# Altium schematic sheet LAN8742A.SchDoc
size A3; SheetNumber: 1; SheetTotal: 16
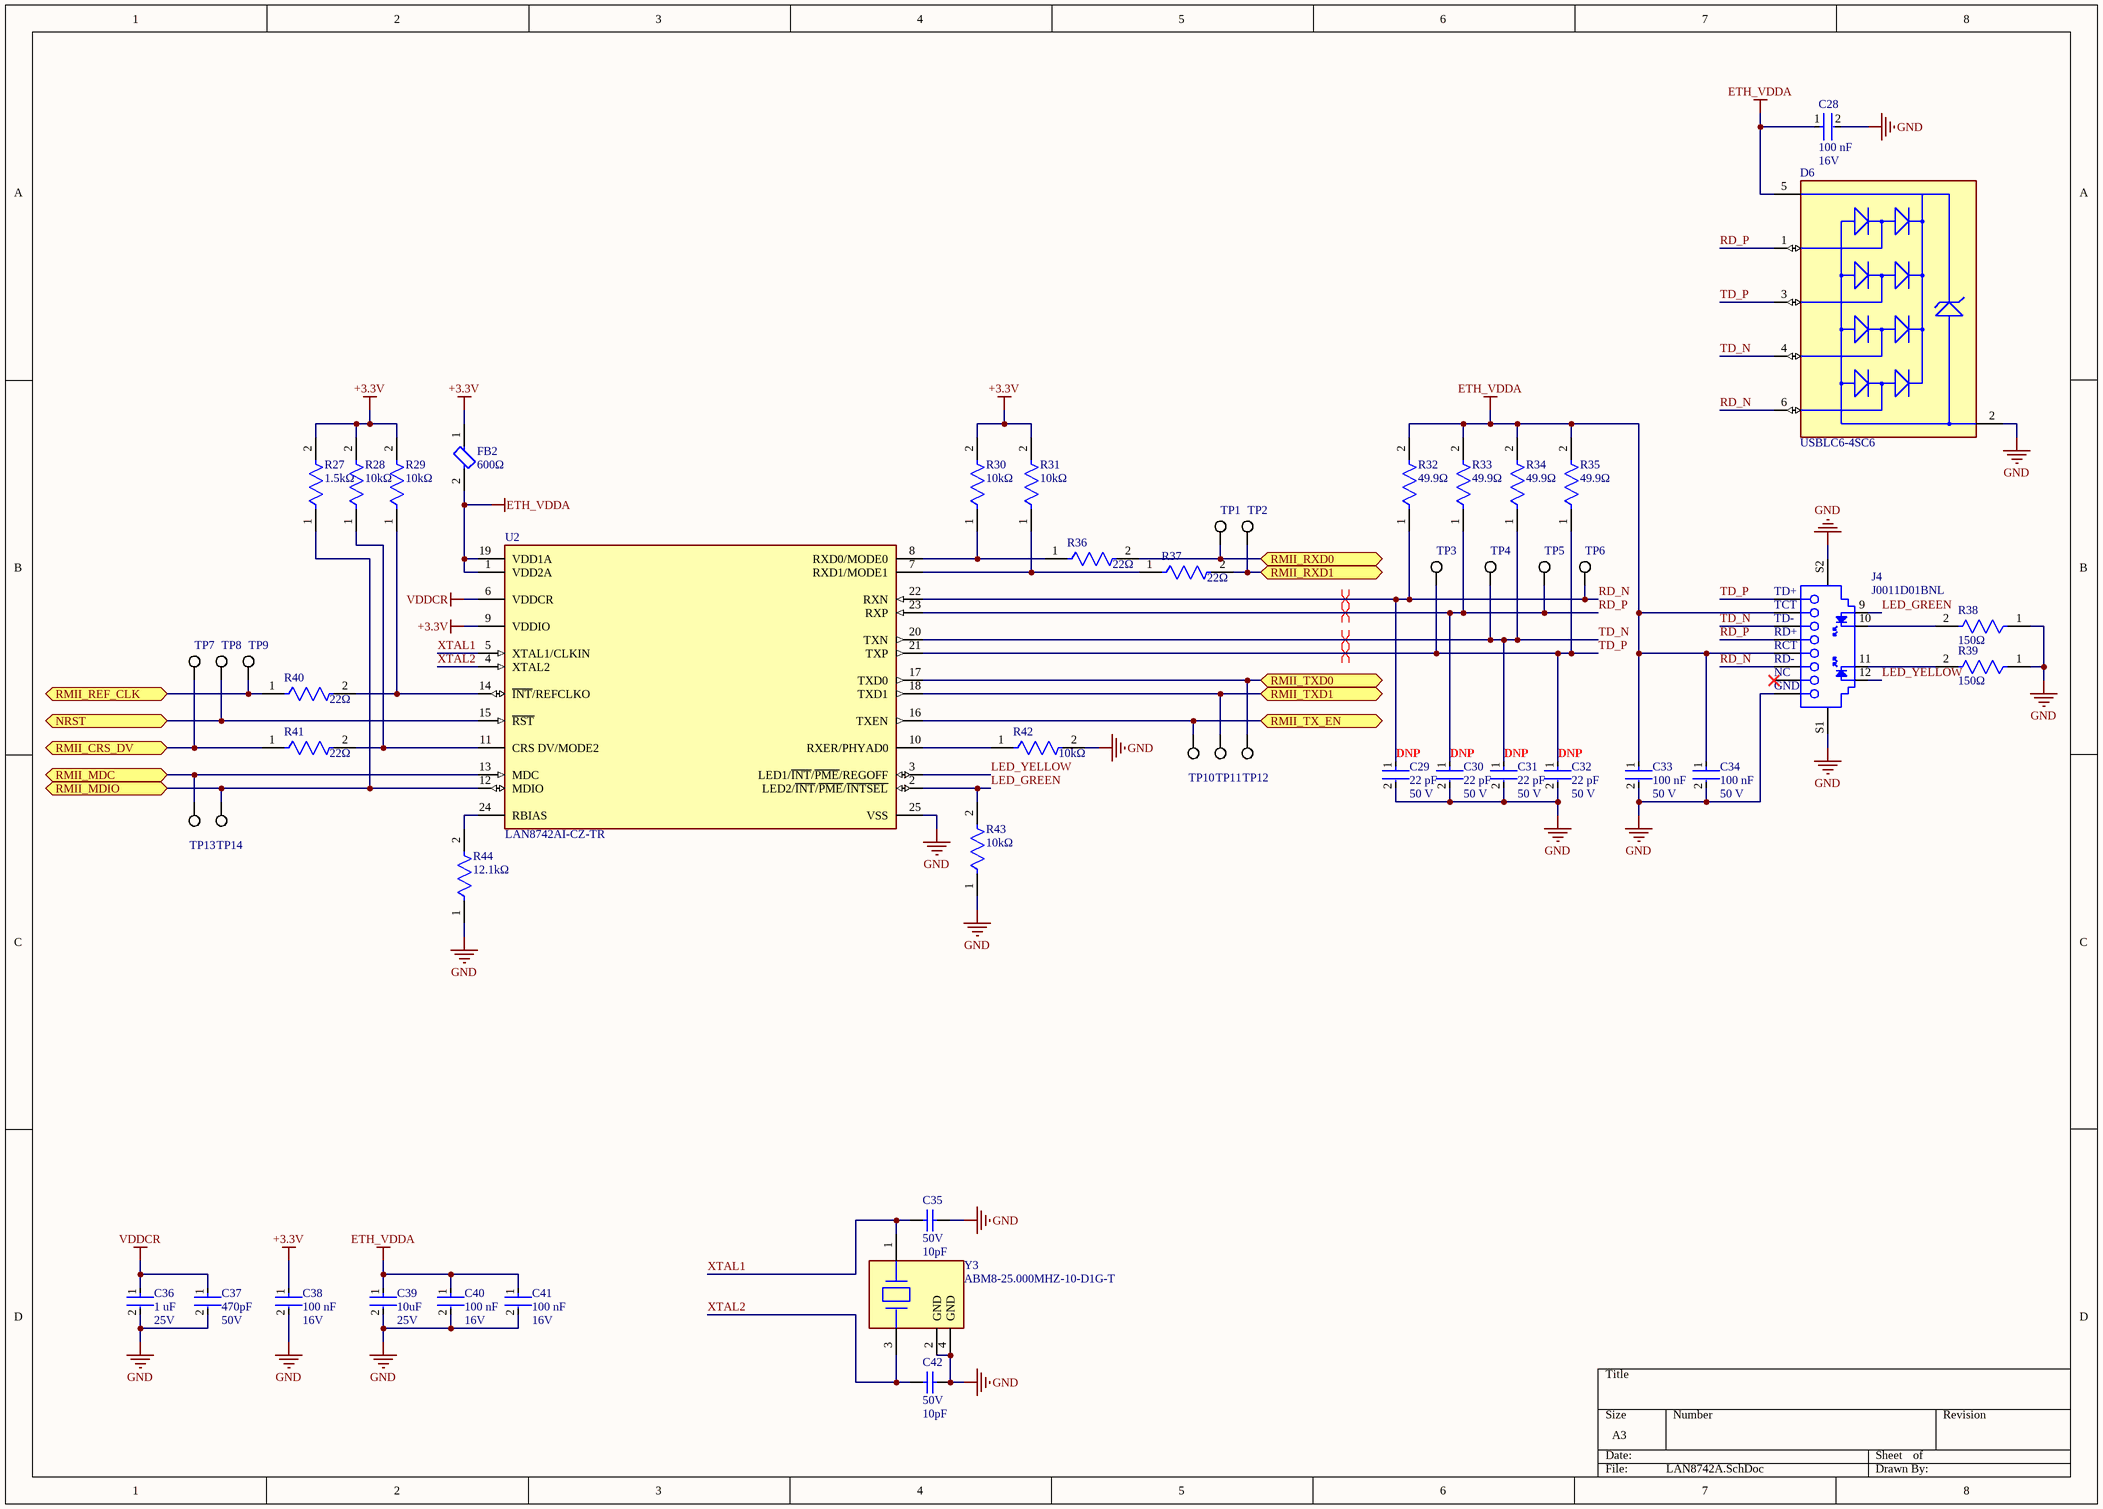
[diagram p0: LAN8742A.SchDoc]

## Parts
C28  Capacitance: 100 nF  Voltage Rating: 16V  [FP-CL752-IPC_B]  (hidden comment: CL05B104KO5VPNC)
C29  Capacitance: 22 pF  Voltage Rating: 50 V  [FP-C0402-BB-IPC_B]  (hidden comment: C0402C220K5GACTU)
C30  Capacitance: 22 pF  Voltage Rating: 50 V  [FP-C0402-BB-IPC_B]  (hidden comment: C0402C220K5GACTU)
C31  Capacitance: 22 pF  Voltage Rating: 50 V  [FP-C0402-BB-IPC_B]  (hidden comment: C0402C220K5GACTU)
C32  Capacitance: 22 pF  Voltage Rating: 50 V  [FP-C0402-BB-IPC_B]  (hidden comment: C0402C220K5GACTU)
C33  value 100 nF  Voltage Rating: 50 V  [FP-C0603C-CF-IPC_B]  (hidden comment: C0603C104M5RACTU)
C34  value 100 nF  Voltage Rating: 50 V  [FP-C0603C-CF-IPC_B]  (hidden comment: C0603C104M5RACTU)
C35  Voltage Rating: 50V  Capacitance: 10pF  [CAPC1005X55X25NL05T05]  (hidden comment: CC0402JRNPO9BN100)
C36  Capacitance: 1 uF  Voltage Rating: 25V  [FP-GCM188-0_1-IPC_B]  (hidden comment: GCM188R71E105KA64D)
C37  Voltage: 50V  Capacitance: 470pF  [FP-0402-L_1_0_1-W_0_5_0_1-MFG]  (hidden comment: 04025C471JAT2A)
C38  Capacitance: 100 nF  Voltage Rating: 16V  [FP-CL752-IPC_B]  (hidden comment: CL05B104KO5VPNC)
C39  Voltage Rating: 25V  Capacitance: 10uF  [FP-C1608-080-IPC_B]  (hidden comment: C1608X5R1E106M080AC)
C40  Capacitance: 100 nF  Voltage Rating: 16V  [FP-CL752-IPC_B]  (hidden comment: CL05B104KO5VPNC)
C41  Capacitance: 100 nF  Voltage Rating: 16V  [FP-CL752-IPC_B]  (hidden comment: CL05B104KO5VPNC)
C42  Voltage Rating: 50V  Capacitance: 10pF  [CAPC1005X55X25NL05T05]  (hidden comment: CC0402JRNPO9BN100)
D6  USBLC6-4SC6  [FP-SOT23-6L-MFG]
FB2  Impedance: 600Ω  [FP-BLM18-0_15-t0_8-IPC_B]  (hidden comment: BLM18AG601SN1D)
J4  J0011D01BNL  [PULS-J0-A_V]
R27  Resistance: 1.5kΩ  [FP-ERJ2RK-MFG]  (hidden comment: ERJ-2RKF1501X)
R28  Resistance: 10kΩ  [FP-AC0402-MFG]  (hidden comment: AC0402FR-0710KL)
R29  Resistance: 10kΩ  [FP-AC0402-MFG]  (hidden comment: AC0402FR-0710KL)
R30  Resistance: 10kΩ  [FP-AC0402-MFG]  (hidden comment: AC0402FR-0710KL)
R31  Resistance: 10kΩ  [FP-AC0402-MFG]  (hidden comment: AC0402FR-0710KL)
R32  Resistance: 49.9Ω  [FP-AC0402-MFG]  (hidden comment: AC0402FR-0749R9L)
R33  Resistance: 49.9Ω  [FP-AC0402-MFG]  (hidden comment: AC0402FR-0749R9L)
R34  Resistance: 49.9Ω  [FP-AC0402-MFG]  (hidden comment: AC0402FR-0749R9L)
R35  Resistance: 49.9Ω  [FP-AC0402-MFG]  (hidden comment: AC0402FR-0749R9L)
R36  Resistance: 22Ω  [FP-AC0402-MFG]  (hidden comment: AC0402FR-0722RL)
R37  Resistance: 22Ω  [FP-AC0402-MFG]  (hidden comment: AC0402FR-0722RL)
R38  Resistance: 150Ω  [FP-CRCW0603-e3-IPC_B]  (hidden comment: CRCW0603150RFKEA)
R39  Resistance: 150Ω  [FP-CRCW0603-e3-IPC_B]  (hidden comment: CRCW0603150RFKEA)
R40  Resistance: 22Ω  [FP-AC0402-MFG]  (hidden comment: AC0402FR-0722RL)
R41  Resistance: 22Ω  [FP-AC0402-MFG]  (hidden comment: AC0402FR-0722RL)
R42  Resistance: 10kΩ  [FP-AC0402-MFG]  (hidden comment: AC0402FR-0710KL)
R43  Resistance: 10kΩ  [FP-RC0603-0_55-IPC_B]  (hidden comment: RC0603FR-0710KL)
R44  Resistance: 12.1kΩ  [FP-ERJ2RK-MFG]  (hidden comment: ERJ-2RKF1212X)
TP1  5019  [KSTN-5019_V]  (value not drawn)
TP2  5019  [KSTN-5019_V]  (value not drawn)
TP3  5019  [KSTN-5019_V]  (value not drawn)
TP4  5019  [KSTN-5019_V]  (value not drawn)
TP5  5019  [KSTN-5019_V]  (value not drawn)
TP6  5019  [KSTN-5019_V]  (value not drawn)
TP7  5019  [KSTN-5019_V]  (value not drawn)
TP8  5019  [KSTN-5019_V]  (value not drawn)
TP9  5019  [KSTN-5019_V]  (value not drawn)
TP10  5019  [KSTN-5019_V]  (value not drawn)
TP11  5019  [KSTN-5019_V]  (value not drawn)
TP12  5019  [KSTN-5019_V]  (value not drawn)
TP13  5019  [KSTN-5019_V]  (value not drawn)
TP14  5019  [KSTN-5019_V]  (value not drawn)
U2  LAN8742AI-CZ-TR  [FP-C04-143-MFG]
Y3  ABM8-25.000MHZ-10-D1G-T  [FP-ABM8-MFG]

## Ports
NRST (bidir), RMII_CRS_DV (bidir), RMII_MDC (bidir), RMII_MDIO (bidir), RMII_REF_CLK (bidir), RMII_RXD0 (bidir), RMII_RXD1 (bidir), RMII_TX_EN (bidir), RMII_TXD0 (bidir), RMII_TXD1 (bidir)

## Nets
+3.3V: C38.1 FB2.1 R27.2 R28.2 R29.2 R30.2 R31.2 U2.9(VDDIO)
ETH_VDDA: C28.1 C33.1 C34.1 C39.1 C40.1 C41.1 D6.5(VBUS) FB2.2 J4.2(TCT) J4.5(RCT) R32.2 R33.2 R34.2 R35.2 U2.1(VDD2A) U2.19(VDD1A)
GND: C28.2 C29.2 C30.2 C31.2 C32.2 C33.2 C34.2 C35.2 C36.2 C37.2 C38.2 C39.2 C40.2 C41.2 C42.2 D6.2(GND) J4.8(GND) J4.S1 J4.S2 R38.1 R39.1 R42.2 R43.1 R44.1 U2.25(VSS) Y3.2(GND) Y3.4(GND)
VDDCR: C36.1 C37.1 U2.6(VDDCR)
LED_GREEN: J4.9 R43.2 U2.2(LED2/~{INT}/~{PME}/~{INTSEL})
LED_YELLOW: J4.12 U2.3(LED1/~{INT}/~{PME}/REGOFF)
NRST: TP8.1 U2.15(~{RST}) ; port NRST
RD_N: C29.1 D6.6(I/O4) J4.6(RD-) R32.1 TP6.1 U2.22(RXN)
RD_P: C30.1 D6.1(I/O1) J4.4(RD+) R33.1 TP5.1 U2.23(RXP)
RMII_CRS_DV: R41.1 TP7.1 ; port RMII_CRS_DV
RMII_MDC: TP13.1 U2.13(MDC) ; port RMII_MDC
RMII_MDIO: R27.1 TP14.1 U2.12(MDIO) ; port RMII_MDIO
RMII_REF_CLK: R40.1 TP9.1 ; port RMII_REF_CLK
RMII_RXD0: R36.2 TP1.1 ; port RMII_RXD0
RMII_RXD1: R37.2 TP2.1 ; port RMII_RXD1
RMII_TX_EN: TP10.1 U2.16(TXEN) ; port RMII_TX_EN
RMII_TXD0: TP12.1 U2.17(TXD0) ; port RMII_TXD0
RMII_TXD1: TP11.1 U2.18(TXD1) ; port RMII_TXD1
TD_N: C31.1 D6.4(I/O3) J4.3(TD-) R34.1 TP4.1 U2.20(TXN)
TD_P: C32.1 D6.3(I/O2) J4.1(TD+) R35.1 TP3.1 U2.21(TXP)
XTAL1: C35.1 U2.5(XTAL1/CLKIN) Y3.1
XTAL2: C42.1 U2.4(XTAL2) Y3.3
NetJ4_10: J4.10 R38.2
NetJ4_11: J4.11 R39.2
NetR28_1: R28.1 R41.2 U2.11(CRS_DV/MODE2)
NetR29_1: R29.1 R40.2 U2.14(~{INT}/REFCLKO)
NetR30_1: R30.1 R36.1 U2.8(RXD0/MODE0)
NetR31_1: R31.1 R37.1 U2.7(RXD1/MODE1)
NetR42_1: R42.1 U2.10(RXER/PHYAD0)
NetR44_2: R44.2 U2.24(RBIAS)

Not connected (* = marked no-connect by the designer): J4 7(NC)*

## Layout directives
differential pair: RD_N, RD_P, TD_N, TD_P

## Notes on the sheet
- (near C29) DNP
- (near C30) DNP
- (near C31) DNP
- (near C32) DNP

## Library data of the parts
C28 C38 C40 C41 = CMP-13271-002128-1: Cap Ceramic 100nF 16V X7R ±10% SMD 0402 +125°C Paper T/R; Length: 0.039inch; Case Code (Metric): 1005; Thickness: 0.022inch; Max Operating Temperature: 125°C; Mount: Surface Mount; Features: Soft Termination; Width: 0.02inch; Min Operating Temperature: -55°C; Tolerance: 10%; Case/Package: 0402; Packaging: Cut Tape; Ratings: AEC-Q200; Case Code (Imperial): 0402; Lead Free: Lead Free
C29-C32 = CMP-2008-03341-2: CAP CER 22PF 50V 10% NP0 0402; Manufacturer: Kemet; Tolerance: 0.1; Material: Ceramic; Temperature Characteristic: C0G; Temperature Coefficient: 15%; ComponentLink2URL: https://content.kemet.com/datasheets/KEM_C1002_X7R_SMD.pdf; Automotive: No; Octopart: https://octopart.com/c0402c220k5gactu-kemet-9144192; Mouser Description: Multilayer Ceramic Capacitors MLCC - SMD/SMT 50volts 22pF C0G 10%; Device Class L2: Capacitors; Device Class L1: Passive Components; Device Class L3: Ceramic Capacitors; Package: C0402-BB; RoHS: TRUE; Value: 22 pF; Temperature: -55°C to +125°C; Category: Cap; ComponentLink2Description: Datasheet; Digikey Description: CAP CER 22PF 50V 10% NP0 0402; Ipc Land Pattern Name: CAPC10050X50; Temperature Range Low: -55°C; Manufacturer Part Number: C0402C220K5GACTU; Temperature Range High: +125°C; Lead Free: Yes; Height: 0.55mm
C33 C34 = CMP-2006-03068-2: CAP CER 0.1UF 50V 20% X7R 0603; Manufacturer: KEMET; Material: Ceramic; Tolerance: 0.2; Temperature Coefficient: 30ppm/°C; Automotive Grade: Grade 1; Capacitance: 0.10 μF; Temperature Range High: +125°C; Device Class L3: Ceramic Capacitors; Manufacturer Part Number: C0603C104M5RACTU; Height: 0.87mm; Category: Cap; RoHS: TRUE; Digikey Description: CAP CER 0.1UF 50V 20% X7R 0603; ComponentLink2URL: https://api.kemet.com/component-edge/download/datasheet/C0603C100J5GACAUTO.pdf; Lead Free: Yes; Temperature Range Low: -55°C; Device Class L1: Passive Components; ComponentLink2Description: Datasheet; Temperature Characteristic: X7R; Automotive: Yes; Temperature: -55°C to +125°C; Octopart: https://octopart.com/c0603c104m5ractu-kemet-11855687; Device Class L2: Capacitors; Package: C0603C-CF; Mouser Description: Multilayer Ceramic Capacitors MLCC - SMD/SMT 50volts 0.1uF X7R 20%
C35 C42 = CMP-2100-03589-1: Chip Capacitor, 10 pF, +/- 5%, 50 V, -55 to 125 degC, 0402 (1005 Metric), RoHS, Tape and Reel; Manufacturer: Yageo; Insulation Resistance: 100GR; Dielectric Material: Ceramic; Temperature Coefficient: 30ppm/degC; Dielectric: C0G; Termination: SMD/SMT; Package Reference: 0402; Voltage Rating (DC): 50V; Lead Free: LeadFree; Composition: Ceramic; Tolerance: 5%; Case Code (Metric): 1005; Packaging: TapeandReel; Manufacturer URL: http://www.yageo.com/; REACH SVHC: NoSVHC; Max Operating Temperature: 125degC; Length: 1mm; Mount: SurfaceMount; Depth: 0.5mm; Min Operating Temperature: -55degC; Number of Pins: 2; Width: 0.02inch; Datasheet Version: Rev. 14, 07/2016; Package Quantity: 1; Datasheet URL: http://www.yageo.com/documents/recent/UPY-GP_NP0_16V-to-50V_14.pdf; Case Code (Imperial): 0402; RoHSCompliant: True; Radiation Hardening: No; Height: 0.5mm; Case/Package: 0402; Thickness: 0.022inch; Package Description: 2-Pin Surface Mount Device, Body 1 x 0.5 mm; Voltage: 50V
C36 = CMP-2006-02363-4: Manufacturer Lifecycle Status: IN PRODUCTION; NexarPartId: 18909256; Dielectric: X7R; Material: Ceramic; Tolerance: 10%; Thickness: 889µm; Max Operating Temperature: 125°C; Radiation Hardening: No; Weight: 6.293594mg; Lead Free: Lead Free; Mount: Surface Mount; Case Code (Imperial): 0603; REACH SVHC: No SVHC; Lifecycle Status: Production; Depth: 800µm; Min Operating Temperature: -55°C; Height: 800µm; Case Code (Metric): 1608; Case/Package: 0603; Voltage: 25V; Packaging: Cut Tape; Length: 1.6mm; Termination: SMD/SMT; Width: 787.4µm; Voltage Rating (DC): 25V; RoHS: Compliant; Schedule B: 8532240020, 8532240020; Ratings: AEC-Q200
C37 = CMP-2008-02727-2: General Purpose Ceramic Capacitor, 0402, 470pF, 5%, X7R, 15%, 50V; Termination: SMD/SMT; Case Code (Imperial): 0402; Series: -; Packaging: Tape and Reel; Max Operating Temperature: 125°C; Contact Plating: Tin; Radiation Hardening: No; Number of Pins: 2; Case Code (Metric): 1005; Lead Free: Lead Free; Package Quantity: 1; RoHS Compliant: Yes; Width: 0.02inch; Length: 1mm; Height: 0.5mm; Voltage Rating (DC): 50V; Thickness: 0.022inch; Tolerance: 5%; Mount: Surface Mount; Case/Package: 0402; Depth: 0.5mm; Min Operating Temperature: -55°C; Construction: Flat; REACH SVHC: No SVHC; Voltage Rating: 50V; Dielectric: X7R
C39 = CMP-2000-05442-2: CAP CER 10UF 25V X5R 0603; Dielectric Material: Ceramic; Tolerance: 20%; Dielectric: X5R; Length: 1.6mm; Termination: SMD/SMT; Depth: 0.8mm; RoHS Compliant: Yes; Construction: Flat; Weight: 7.1E-05oz; Thickness: 0.039inch; Packaging: Tape and Reel; Min Operating Temperature: -55°C; Case Code (Imperial): 0603; Case/Package: 0603; Height: 0.8mm; Case Code (Metric): 1608; Resistor Type: Ceramic; Voltage Rating (DC): 25V; Max Operating Temperature: 85°C; REACH SVHC: No SVHC; Lead Free: Lead Free; Series: C; Width: 0.8mm; Mount: Surface Mount; Package Quantity: 1
D6 = CMP-2000-07370-2: TVS DIODE 5.25V 17V SOT23-6; Manufacturer: STMicroelectronics; Peak Pulse Power: 130W; Breakdown Voltage: 6V; Value: 3pF; Direction: Unidirectional; Interface: USB,Ethernet,Other; Number Of Channels: 4; Standoff Height: 0mm; Max Junction Temp: +125°C; Digikey Description: TVS DIODE 5.25V 17V SOT23-6; Automotive: No; Package: SOT23-6L; Mouser Description: USBLC6 Series 4 Line 6 V Uni / Bi-Directional ESD Protection - SOT-23-6; Octopart: https://octopart.com/usblc6-4sc6-stmicroelectronics-347147; RoHS: TRUE; ComponentLink2URL: https://upverter.com/datasheet/23dc4ffb028d868909e80577610284b194f13213.pdf; ComponentLink2Description: Datasheet; Device Class L1: Circuit Protection; Lead Free: Yes; Temperature Range High: +125°C; Device Class L2: ESD and Circuit Protection ICs; Device Class L3: unset; Capacitance: 3pF; Height: 1.45mm; Temperature Range Low: -40°C; Manufacturer Part Number: USBLC6-4SC6; Temperature: -40°C to +125°C; Category: Diode; Clamping Voltage: 17V
FB2 = CMP-0686-00436-3: Chip Ferrite Bead, 0603, 600Ω @ 100MHz, 0.38Ω, 25%, 500mA; Number of Lines: 1; DC Resistance (DCR): 380mR; Material: Steel; Shielding: Unshielded; Max DC Current: 500mA; Termination: SMD/SMT; Military Standard: Not; Number of Circuits: 1; Min Operating Temperature: -55°C; Case Code (Imperial): 0603; Width: 0.8mm; Current Rating: 500mA; Lead Free: Lead Free; Packaging: Tape and Reel; Frequency: 100MHz; Max Operating Temperature: 125°C; DC Current: 500mA; REACH SVHC: No SVHC; Case/Package: 0603; Package Quantity: 1; Height: 0.8mm; Number of Pins: 2; Depth: 0.8mm; Test Frequency: 100MHz; Case Code (Metric): 1608; Tolerance: 25%; Core Material: Ferrite; Weight: 7.1E-05oz; Max Current Rating: 500mA; Radiation Hardening: No; Length: 1.6mm; RoHS Compliant: Yes
J4 = CMP-2000-06492-1: RJ45 Connector, Pitch 1.27 mm, 12 Position, Height 13.84 mm, Tail Length 3.3 mm, 0 to 70 degC, RoHS, Tray; Manufacturer: Pulse Electronics; Dynamic Catalog: PULSEJACK™J0andJ2Series; Shield Material: Brass; Shielding: Shielded; LED Color: Green-Yellow; Number of Ports: 1; Number of Cores per Jack: 4; Catalog Drawings: PULSEJACKRightAngle1x1; Other Names: 553-1483 / J0011D01BNL-ND; Tab Direction: Down; Package Description: RJ45 Connector, Pitch 1.27 mm, 12 Position, Height 13.84 mm, Tail Length 3.3 mm; Number of Rows: 1; Contact Finish Thickness: 15µin(0.38µm); Datasheet URL: http://productfinder.pulseeng.com/products/datasheets/J403.pdf; Connector Type: RJ45; Mounting Type: ThroughHole; Package Reference: J0-A; Orientation: 90°Angle(Right); Termination: Solder; Datasheet Version: Rev. K, 08/2012; Applications: 10/100Base-TX,AutoMDIX; Series: PULSEJACK™J0; Contact Finish: Gold; Height Above Board: 0.545"(13.84mm); Operating Temperature: 0°C~70°C; Packaging: Tray; Contact Material: PhosphorBronze; Standard Package: 30; Housing Material: Thermoplastic; Features: BoardGuide; Category: Connectors,Interconnects; Mounting Technology: ThroughHole; Manufacturer URL: http://www.pulseelectronics.com/; Family: ModularConnectors-JacksWithMagnetics
R27 = CMP-2002-00693-2: RES SMD 1.5K OHM 1% 1/10W 0402; Voltage Rating (DC): 50V; Temperature Coefficient: 100ppm/°C; Power Rating: 100mW; Features: Automotive AEC-Q200; Termination: SMD/SMT; Size Code: 0402; Mount: Surface Mount; Min Operating Temperature: -55°C; Construction: Rectangular; Case Code (Metric): 1005; Depth: 0.5mm; Max Operating Temperature: 155°C; RoHS Compliant: Yes; Packaging: Tape and Reel; Number of Pins: 2; Military Standard: Not; Package Quantity: 1; Height: 0.35mm; Resistor Type: Thick Film; Radiation Hardening: No; Length: 1mm; Case Code (Imperial): 0402; Tolerance: 1%; Voltage Rating: 50V; Resistance Tolerance: 1%; Contact Plating: Tin; Case/Package: 0402; REACH SVHC: No SVHC; Max Power Dissipation: 100mW; Series: ERJ; Technology: THICK FILM; Number of Terminations: 2; Width: 0.02inch; Lead Free: Lead Free
R28-R31 R42 = CMP-2002-01790-3: RES 10kΩ ±1% 0.063W 0402; Power Rating: 62.5mW; Voltage Rating: 50V; Temperature Coefficient: 100ppm/°C; Max Power Dissipation: 63mW; Tolerance: 1%; Military Standard: Not; Construction: Rectangular; Termination: SMD/SMT; Max Operating Temperature: 155°C; Min Operating Temperature: -55°C; Height: 0.015inch; Lead Free: Lead Free; Width: 0.02inch; Case/Package: 0402; Resistor Type: Thick Film; Series: AC; Features: Moisture Resistant; RoHS Compliant: Yes; Number of Terminations: 2; Case Code (Metric): 1005; Length: 0.039inch; Depth: 0.5mm; Size Code: 0402; Packaging: Tape and Reel; Case Code (Imperial): 0402
R32-R35 = CMP-2002-01781-3: RES 49.9Ω ±1% 0.063W 0402; Voltage Rating: 50V; Power Rating: 62.5mW; Temperature Coefficient: 100ppm/°C; Max Power Dissipation: 63mW; Termination: SMD/SMT; RoHS Compliant: Yes; Series: AC; Width: 0.5mm; Size Code: 0402; Weight: 2.3E-05oz; Case/Package: 0402; Max Operating Temperature: 155°C; Tolerance: 1%; Features: Moisture Resistant; Min Operating Temperature: -55°C; Length: 0.039inch; Case Code (Metric): 1005; Lead Free: Lead Free; Height: 0.015inch; Case Code (Imperial): 0402; Number of Terminations: 2; Resistor Type: Thick Film; Packaging: Tape and Reel
R36 R37 R40 R41 = CMP-2002-01805-3: RES 22Ω ±1% 0.063W 0402; Power Rating: 62.5mW; Voltage Rating: 50V; Temperature Coefficient: 100ppm/°C; Max Power Dissipation: 63mW; RoHS Compliant: Yes; Case Code (Imperial): 0402; Termination: SMD/SMT; Series: AC; Number of Terminations: 2; Tolerance: 1%; Case Code (Metric): 1005; Packaging: Tape and Reel; Features: Moisture Resistant; Height: 0.015inch; Case/Package: 0402; Max Operating Temperature: 155°C; Resistor Type: Thick Film; Min Operating Temperature: -55°C; Width: 0.5mm; Size Code: 0402; Lead Free: Lead Free; Length: 0.039inch
R38 R39 = CMP-2000-03913-2: RES Thick Film, 150Ω, 1%, 0.1W, 100ppm/°C, 0603; Voltage Rating (DC): 75V; Max Power Dissipation: 100mW; Features: Automotive AEC-Q200; Weight: 7.1E-05oz; Number of Terminations: 2; Temperature Coefficient: 100ppm/°C; Military Standard: Not; Length: 1.55mm; Min Operating Temperature: -55°C; Termination: SMD/SMT; Tolerance: 1%; Composition: Thick Film; Depth: 0.85mm; Max Operating Temperature: 155°C; Width: 0.033inch; Lead Free: Lead Free; Height: 0.45mm; Case Code (Metric): 1608; Package Quantity: 10; Case Code (Imperial): 0603; Voltage Rating: 75V; Radiation Hardening: No; Contact Plating: Tin; Mount: Surface Mount; Packaging: Tape and Reel; Power Rating: 100mW; Case/Package: 0603
R43 = CMP-2100-03664-2: RES 10K OHM 1% 1/10W 0603; Voltage Rating: 75V; Voltage Rating (DC): 50V; Power Rating: 100mW; Temperature Coefficient: 100ppm/°C; Depth: 0.8mm; Termination: SMD/SMT; Resistor Type: Thick Film; Series: RC; Construction: Rectangular; Features: Moisture Resistant; Packaging: Tape and Reel; Min Operating Temperature: -55°C; Number of Terminations: 2; Lead Pitch: 0.3mm; RoHS Compliant: Yes; Case/Package: 0603; Resistance Tolerance: 1%; Military Standard: Not; Weight: 7.1E-05oz; Number of Pins: 2; Tolerance: 1%; Length: 1.6mm; Case Code (Imperial): 0603; Lead Free: Lead Free; Width: 0.8mm; Max Power Dissipation: 100mW; Height: 0.45mm; Max Operating Temperature: 155°C; Case Code (Metric): 1608; Size Code: 0603
R44 = CMP-2002-00649-2: RES SMD 12.1K OHM 1% 1/10W 0402; Voltage Rating (DC): 50V; Power Rating: 100mW; Temperature Coefficient: 100ppm/°C; Width: 0.02inch; Military Standard: Not; Resistance Tolerance: 1%; Resistor Type: Thick Film; Voltage Rating: 50V; Case/Package: 0402; Packaging: Tape and Reel; Series: ERJ; Number of Terminations: 2; Case Code (Metric): 1005; Radiation Hardening: No; Min Operating Temperature: -55°C; Construction: Rectangular; Technology: THICK FILM; RoHS Compliant: Yes; Termination: SMD/SMT; Contact Plating: Tin; Max Operating Temperature: 155°C; Max Power Dissipation: 100mW; Tolerance: 1%; Features: Automotive AEC-Q200; Height: 0.35mm; REACH SVHC: No SVHC; Depth: 0.5mm; Case Code (Imperial): 0402; Lead Free: Lead Free; Length: 1mm; Mount: Surface Mount; Package Quantity: 1
TP1-TP14 = CMP-1672-00008-1: Test Point, 1 Position SMD, RoHS, Tape and Reel; ComponentLink1Description: Manufacturer URL; Package Quantity: 1000; DatasheetVersion: 03/2014; Packaging: Tape and Reel; ComponentLink2URL: http://www.keyelco.com/product-pdf.cfm?p=1357; ComponentLink1URL: http://www.keyelco.com/; Mount: Surface Mount; Contact Plating: Silver; PackageDescription: 1-Pin Surface Mount Device, Body 3.81 x 2.03 mm; Pins: 1; RoHSCompliant: True; Mounting Technology: Surface Mount; ComponentLink2Description: Datasheet; PackageReference: 5019
U2 = CMP-06281-000002-1: IC TRANSCEIVER FULL 1/1 24SQFN; Manufacturer: Microchip; Simplex Duplex: Full Duplex; Max Supply Voltage: 3.6V; Standoff Height: 0mm; Number Of Channels: 1; Data Rate: 100Mbits/s; Interface: Ethernet,Other; Min Supply Voltage: 1.14V; Ambient Temperature Range Low: -40°C; Height: 1mm; Digikey Description: IC TRANSCEIVER FULL 1/1 24SQFN; Lead Free: Yes; Category: IC; Temperature Range Low: -40°C; Temperature: -40°C to +85°C; RoHS: TRUE; ComponentLink2URL: http://ww1.microchip.com/downloads/en/DeviceDoc/DS_LAN8742_00001989A.pdf; Package: C04-143; Mouser Description: Small Footprint RMII 10/100 Ethernet Transceiver with flexPWR Technology; Device Class L1: Integrated Circuits (ICs); Temperature Range High: +85°C; Device Class L2: Interface ICs; ComponentLink2Description: Datasheet; Manufacturer Part Number: LAN8742AI-CZ-TR; Device Class L3: Ethernet Interface ICs; Ambient Temperature Range High: +85°C; Ipc Land Pattern Name: QFN50P400X400X90-24; Octopart: https://octopart.com/lan8742ai-cz-tr-microchip-29030589; Automotive: No
Y3 = CMP-27762-010178-1: Crystal 25MHz ±10ppm 10pF SMD-4 3.2mm x 2.5mm; Frequency Stability: 15ppm; ESR (Equivalent Series Resistance): 50R; Mount: Surface Mount; Load Capacitance: 10pF; Frequency Tolerance: 10ppm; Max Operating Temperature: 85°C; Frequency: 25MHz; Case/Package: SMD/SMT; Length: 0.126inch; RoHS Compliant: Yes; Min Operating Temperature: -40°C; Width: 0.098inch; Height: 0.031inch; Packaging: Tape and Reel